# Altium schematic sheet VREF.SchDoc
size A; SheetNumber: 2; SheetTotal: 6
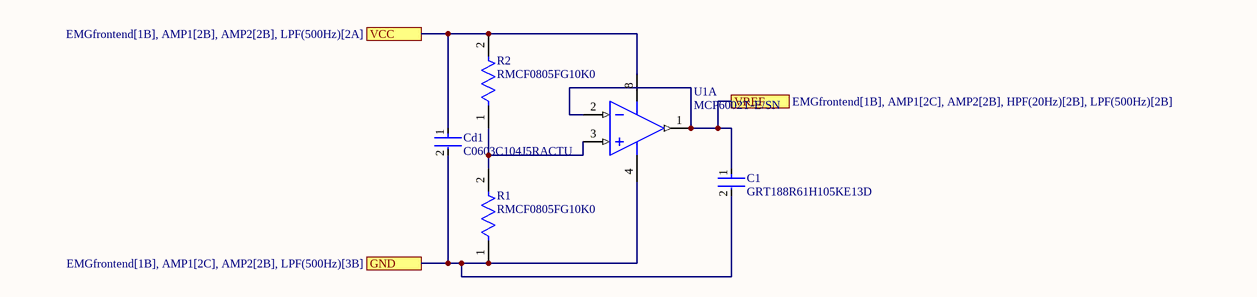
[diagram p0: VREF.SchDoc]

## Parts
C1  GRT188R61H105KE13D  [FP-GRT188-0_1-e0_2_0_5-IPC_B]
Cd1  C0603C104J5RACTU  [FP-C0603C-CF-MFG]
R1  RMCF0805FG10K0  [FP-RMCF0805-IPC_A]
R2  RMCF0805FG10K0  [FP-RMCF0805-IPC_A]
U1  MCP6002T-E/SN  [SOIC-SN8_N]  (part A of 2)

## Ports
GND (see EMGfrontend[1B], AMP1[2C], AMP2[2B], LPF(500Hz)[3B]), VCC (see EMGfrontend[1B], AMP1[2B], AMP2[2B], LPF(500Hz)[2A]), VREF (see EMGfrontend[1B], AMP1[2C], AMP2[2B], HPF(20Hz)[2B], LPF(500Hz)[2B])

## Nets
GND: C1.2 Cd1.2 R1.1 U1.4(VSS) ; port GND
VCC: Cd1.1 R2.2 U1.8(VDD) ; port VCC
VREF: C1.1 U1.1(VOUTA) U1.2(VINA-) ; port VREF
NetR1_2: R1.2 R2.1 U1.3(VINA+)

## Library data of the parts
C1 = CMP-06035-031856-1: Multi-Layer Ceramic Capacitor 1uF 50V X5R ±10% 0603 Paper T/R; Voltage Rating (DC): 50V; Voltage Rating: 50V; Min Operating Temperature: -55°C; Case Code (Metric): 1608; Thickness: 0.035inch; Width: 0.031inch; Capacitance: 1uF; Tolerance: 10%; Max Operating Temperature: 85°C; Dielectric: X5R; Case Code (Imperial): 0603; Case/Package: 0603; Length: 0.063inch; Packaging: Tape and Reel; Mount: Surface Mount; Ratings: AEC-Q200
Cd1 = CMP-2006-03056-2: CAP CER 0.1UF 50V 5% X7R 0603; Manufacturer: KEMET; Automotive Grade: Grade 1; Tolerance: 0.05; Capacitance: 0.10 μF; Value: 0.10 μF; Temperature Coefficient: 30ppm/°C; ComponentLink2Description: Datasheet; Voltage Rating: 50 V; Digikey Description: CAP CER 0.1UF 50V 5% X7R 0603; Manufacturer Part Number: C0603C104J5RACTU; Temperature Range High: +125°C; Device Class L2: Capacitors; Octopart: https://octopart.com/c0603c104j5ractu-kemet-10440638; RoHS: TRUE; Mouser Description: Multilayer Ceramic Capacitors MLCC - SMD/SMT 50volts 0.1uF X7R 5%; Temperature Range Low: -55°C; Automotive: Yes; Lead Free: Yes; ComponentLink2URL: https://api.kemet.com/component-edge/download/datasheet/C0603C100J5GACAUTO.pdf; Material: Ceramic; Device Class L3: Ceramic Capacitors; Package: C0603C-CF; Category: Cap; Temperature: -55°C to +125°C; Height: 0.87mm; Temperature Characteristic: X7R; Device Class L1: Passive Components
R1 R2 = CMP-26527-002739-1: 10kΩ ±1% 0.125W 0805 Thick Film Chip Resistor AEC-Q200 compliant; Resistance: 10kR; Max Power Dissipation: 125mW; Temperature Coefficient: 100ppm/°C; Construction: Rectangular; Case/Package: 0805; Contact Plating: Tin; RoHS Compliant: Yes; Mount: Surface Mount; Case Code (Metric): 2012; Radiation Hardening: No; Packaging: Tape and Reel; Case Code (Imperial): 0805; Tolerance: 1%; Max Operating Temperature: 155°C; Length: 0.079inch; Min Operating Temperature: -55°C; Features: Automotive AEC-Q200; Width: 0.049inch; Height: 0.026inch; Depth: 1.25mm; Number of Terminations: 2; Resistor Type: Thick Film; Series: RMCF; Military Standard: Not
U1 = CMP-0187-00363-3: None; Nominal Supply Current: 100uA; Operating Supply Voltage: 5.5V; Input Bias Current: 1pA; Output Current per Channel: 23mA; Unity Gain Bandwidth Product: 1MHz; Number of Elements: 2; Power Supply Rejection Ratio (PSRR): 86dB; Slew Rate: 0.6V/µs; Min Supply Voltage: 1.8V; Voltage Gain: 112dB; Max Supply Voltage: 6V; Input Offset Voltage (Vos): 4.5mV; Common Mode Rejection Ratio: 60dB; Amplifier Type: GENERAL PURPOSE; Technology: CMOS; Output Current: 23mA; Number of Pins: 8; Lead Free: Lead Free; Number of Channels: 2; Package Quantity: 3300; Max Operating Temperature: 125°C; Number of Circuits: 2; Supply Current: 100uA; Gain Bandwidth Product: 1MHz; Min Operating Temperature: -40°C; Series: -; Mount: Surface Mount; Case/Package: SOIC; Radiation Hardening: No; Packaging: Tape and Reel; Operating Supply Current: 100uA; RoHS Compliant: Yes